# Altium schematic sheet ph.SchDoc: Science Board pH Sensing
size A4
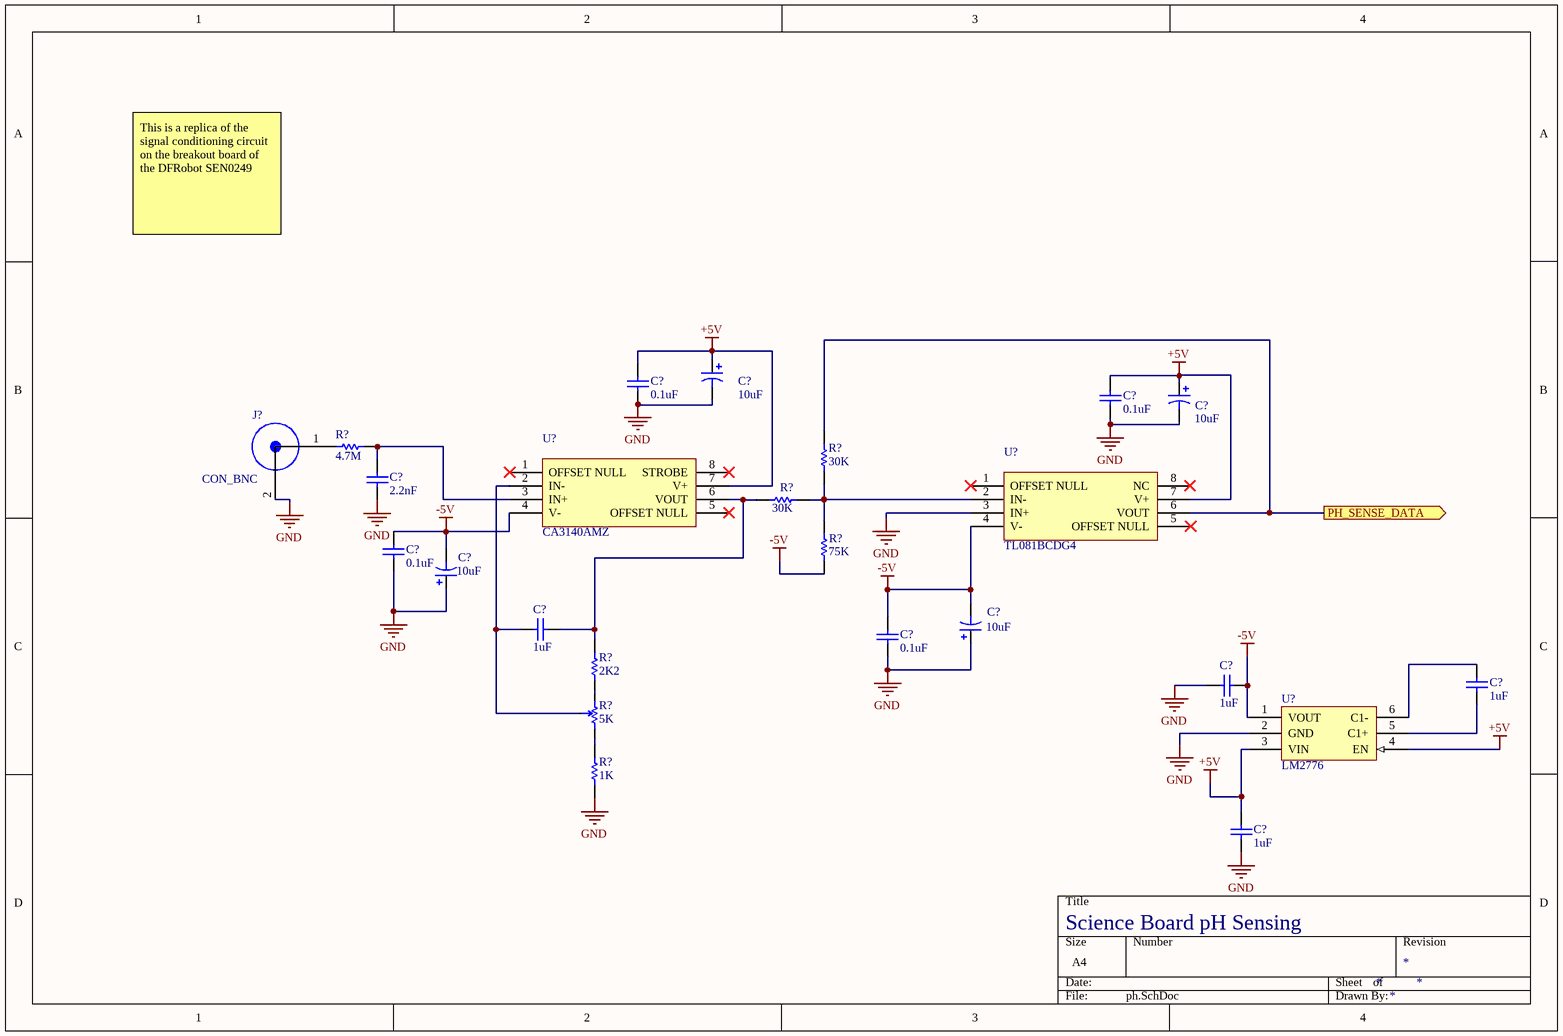
[diagram p0: ph.SchDoc]

## Parts
(Parts that share a designator on the sheet are numbered #1, #2 ... from top to bottom, then left to right.)
C?#1  value 10uF  [AVX-CAPC3528_V]  (hidden comment: CAP_10uF_0603_POL)
C?#2  value 0.1uF  [CAPC0603(1608)55_N]  (hidden comment: CAP_0.1uF_50V_0603)
C?#3  value 10uF  [AVX-CAPC3528_V]  (hidden comment: CAP_10uF_0603_POL)
C?#4  value 0.1uF  [CAPC0603(1608)55_N]  (hidden comment: CAP_0.1uF_50V_0603)
C?#5  value 2.2nF  [CAPC0603(1608)55_N]  (hidden comment: CAP_2.2nF_0603)
C?#6  value 0.1uF  [CAPC0603(1608)55_N]  (hidden comment: CAP_0.1uF_50V_0603)
C?#7  value 10uF  [AVX-CAPC3528_V]  (hidden comment: CAP_10uF_0603_POL)
C?#8  value 1uF  [CAPC0603(1608)55_N]  (hidden comment: CAP_1uF_16V_0603)
C?#9  value 10uF  [AVX-CAPC3528_V]  (hidden comment: CAP_10uF_0603_POL)
C?#10  value 0.1uF  [CAPC0603(1608)55_N]  (hidden comment: CAP_0.1uF_50V_0603)
C?#11  value 1uF  [CAPC0603(1608)55_N]  (hidden comment: CAP_1uF_16V_0603)
C?#12  value 1uF  [CAPC0603(1608)55_N]  (hidden comment: CAP_1uF_16V_0603)
C?#13  value 1uF  [CAPC0603(1608)55_N]  (hidden comment: CAP_1uF_16V_0603)
J?  CON_BNC  [1-1337543-0]
R?#1  value 4.7M  [RESC0603(1608)_N]  (hidden comment: RES_4M7_0603)
R?#2  value 30K  [RESC0603(1608)_N]  (hidden comment: RES_30K_0603)
R?#3  value 30K  [RESC0603(1608)_N]  (hidden comment: RES_30K_0603)
R?#4  value 75K  [RESC0603(1608)_N]  (hidden comment: RES_75K_0603)
R?#5  value 2K2  [RESC0603(1608)_N]  (hidden comment: RES_2K2_0603)
R?#6  value 5K  [3362P-1-502LF]  (hidden comment: POT_5K)
R?#7  value 1K  [RESC0603(1608)_N]  (hidden comment: RES_1K_0603)
U?#1  CA3140AMZ  [CA3140AMZ]
U?#2  TL081BCDG4  [TL081BCDG4]
U?#3  LM2776  [SOT23-6]

## Ports
PH_SENSE_DATA (out)

## Nets
+5V: C?#1.1 C?#2.2 C?#3.1 C?#4.2 C?#13.2 U?#1.7(V+) U?#2.7(V+) U?#3.3(VIN) U?#3.4(EN)
-5V: C?#6.2 C?#7.2 C?#9.2 C?#10.2 C?#12.1 R?#4.1 U?#1.4(V-) U?#2.4(V-) U?#3.1(VOUT)
GND: C?#1.2 C?#2.1 C?#3.2 C?#4.1 C?#5.1 C?#6.1 C?#7.1 C?#9.1 C?#10.1 C?#12.2 C?#13.1 J?.2 R?#7.1 U?#2.3(IN+) U?#3.2(GND)
PH_SENSE_DATA: R?#2.2 U?#2.6(VOUT) ; port PH_SENSE_DATA
NetC?#5_2: C?#5.2 R?#1.2 U?#1.3(IN+)
NetC?#8_1: C?#8.1 R?#6.3 U?#1.2(IN-)
NetC?#8_2: C?#8.2 R?#3.1 R?#5.2 U?#1.6(VOUT)
NetC?#11_1: C?#11.1 U?#3.5(C1+)
NetC?#11_2: C?#11.2 U?#3.6(C1-)
NetJ?_1: J?.1 R?#1.1
NetR?#2_1: R?#2.1 R?#3.2 R?#4.2 U?#2.2(IN-)
NetR?#5_1: R?#5.1 R?#6.1
NetR?#6_2: R?#6.2 R?#7.2

Not connected (* = marked no-connect by the designer): U?#1 1(OFFSET_NULL)* 5(OFFSET_NULL)* 8(STROBE)*; U?#2 1(OFFSET_NULL)* 5(OFFSET_NULL)* 8(NC)*

## Notes on the sheet
- This is a replica of the signal conditioning circuit on the breakout board of the DFRobot SEN0249

## Library data of the parts
C?#1 C?#3 C?#7 C?#9 = CAP_10uF_0603_POL: Capacitor, Tantalum, 10uF 10% 20V MCCT-B (3528); Part Number: CC0603MRX5R6BB106; Manufacturer: Yageo; Temperature Coefficient: X5R; Voltage Rating: 10V; Dimensions: 0.063" L x 0.031" W (1.60mm x 0.80mm); Package: 0603 (1608 Metric)
C?#2 C?#4 C?#6 C?#10 = CAP_0.1uF_50V_0603: CAP CER 0.1UF 50V X7R 0603; Manufacturer: Yageo; MPN: CC0603KRX7R9BB104; Dimensions: 0.063" L x 0.031" W (1.60mm x 0.80mm); Package: 0603 (1608 Metric); Temperature Coefficient: X7R; Voltage Rating: 50V; Digikey Part Number: 311-1344-1-ND
C?#5 = CAP_2.2nF_0603: CAP CER 2.2NF 25V X7R 0603; Manufacturer: Yageo; MPN: CC0603KRX7R8BB222; Dimensions: 0.063" L x 0.031" W (1.60mm x 0.80mm); Package: 0603 (1608 Metric); Temperature Coefficient: X7R; Voltage Rating: 25V; Digikey Part Number: 311-3653-1-ND
C?#8 C?#11-C?#13 = CAP_1uF_16V_0603: CAP CER 1UF 16V Y5V 0603; Manufacturer: Yageo; MPN: CC0603ZRY5V7BB105; Dimensions: 0.063" L x 0.031" W (1.60mm x 0.80mm); Package: 0603 (1608 Metric); Temperature Coefficient: Y5V; Voltage Rating: 16V; Digikey Part Number: 311-1372-1-ND
J? = CON_BNC: Manufacturer: TE Connectivity; MPN: 1-1337543-0; Digikey Part Number: A97553-ND
R?#1 = RES_4M7_0603: RES SMD 4.7M OHM 1% 1/10W 0603; Manufacturer: Yageo; MPN: RC0603FR-074M7L; Package: 0603 (1608 Metric); Dimensions: 0.063" L x 0.031" W (1.60mm x 0.80mm); Tolerance: 1%; Digikey Part Number: 311-4.70MHRCT-ND
R?#2 R?#3 = RES_30K_0603: RES SMD 30K OHM 0.5% 1/10W 0603; Manufacturer: Yageo; MPN: RT0603DRD0730KL; Package: 0603 (1608 Metric); Dimensions: 0.063" L x 0.031" W (1.60mm x 0.80mm); Tolerance: 0.5%; Digikey Part Number: 311-30KDCT-ND
R?#4 = RES_75K_0603: RES SMD 75K OHM 0.5% 1/10W 0603; Manufacturer: Yageo; MPN: RT0603DRD0775KL; Package: 0603 (1608 Metric); Dimensions: 0.063" L x 0.031" W (1.60mm x 0.80mm); Tolerance: 0.5%; Digikey Part Number: 311-75KDCT-ND
R?#5 = RES_2K2_0603: RES SMD 2.2K OHM 1% 1/10W 0603; Manufacturer: Yageo; MPN: RC0603FR-072K2L; Dimensions: 0.063" L x 0.031" W (1.60mm x 0.80mm); Package: 0603 (1608 Metric); Tolerance: 1%; Digikey Part Number: 311-2.20KHRCT-ND
R?#6 = POT_5K: TRIMMER 5K OHM 0.5W PC PIN TOP; Manufacturer: Bourns Inc.; Tolerance: 10%; Dimensions: 0.275" x 0.260" Face x 0.185" H (6.99mm x 6.60mm x 4.70mm); MPN: 3362P-1-502LF; Digikey Part Number: 3362P-502LF-ND
R?#7 = RES_1K_0603: RES SMD 1K OHM 5% 1/10W 0603; Manufacturer: Yageo; MPN: RC0603JR-071KL; Dimensions: 0.063" L x 0.031" W (1.60mm x 0.80mm); Tolerance: 5%; Package: 0603 (1608 Metric); Digikey Part Number: 311-1.0KGRCT-ND
U?#1 = CA3140AMZ: 4.5MHz, BiMOS Operational Amplifier with MOSFET Input/Bipolar Output; Manufacturer: Renesas Electronics America Inc.; Digikey Part Number: CA3140AMZ-ND; MPN: CA3140AMZ
U?#2 = TL081BCDG4: IC OPAMP JFET 3MHZ 8SOIC; Manufacturer: Texas Instruments; MPN: TL081BCD; Digikey Part Number: 296-34259-5-ND
U?#3 = LM2776: LM2776 Switched Capacitor Inverter; MPN: LM2776DBVR; Manufacturer: Texas Instruments; Digikey Part Number: 296-43957-1-ND